# EasyEDA Pro project ProPrj_Backlight_esp32_dm135_2026-01-07.epro

# Schematic Schematic1
Board Name: Board1; Create Date: 2026-01-04; Page Name: P1; Project Name: Backlight_esp32_dm135; Schematic Name: Schematic1; Update Date: 2026-01-04; Company: EasyEDA.com; Page Size: A4; Version: V1.0
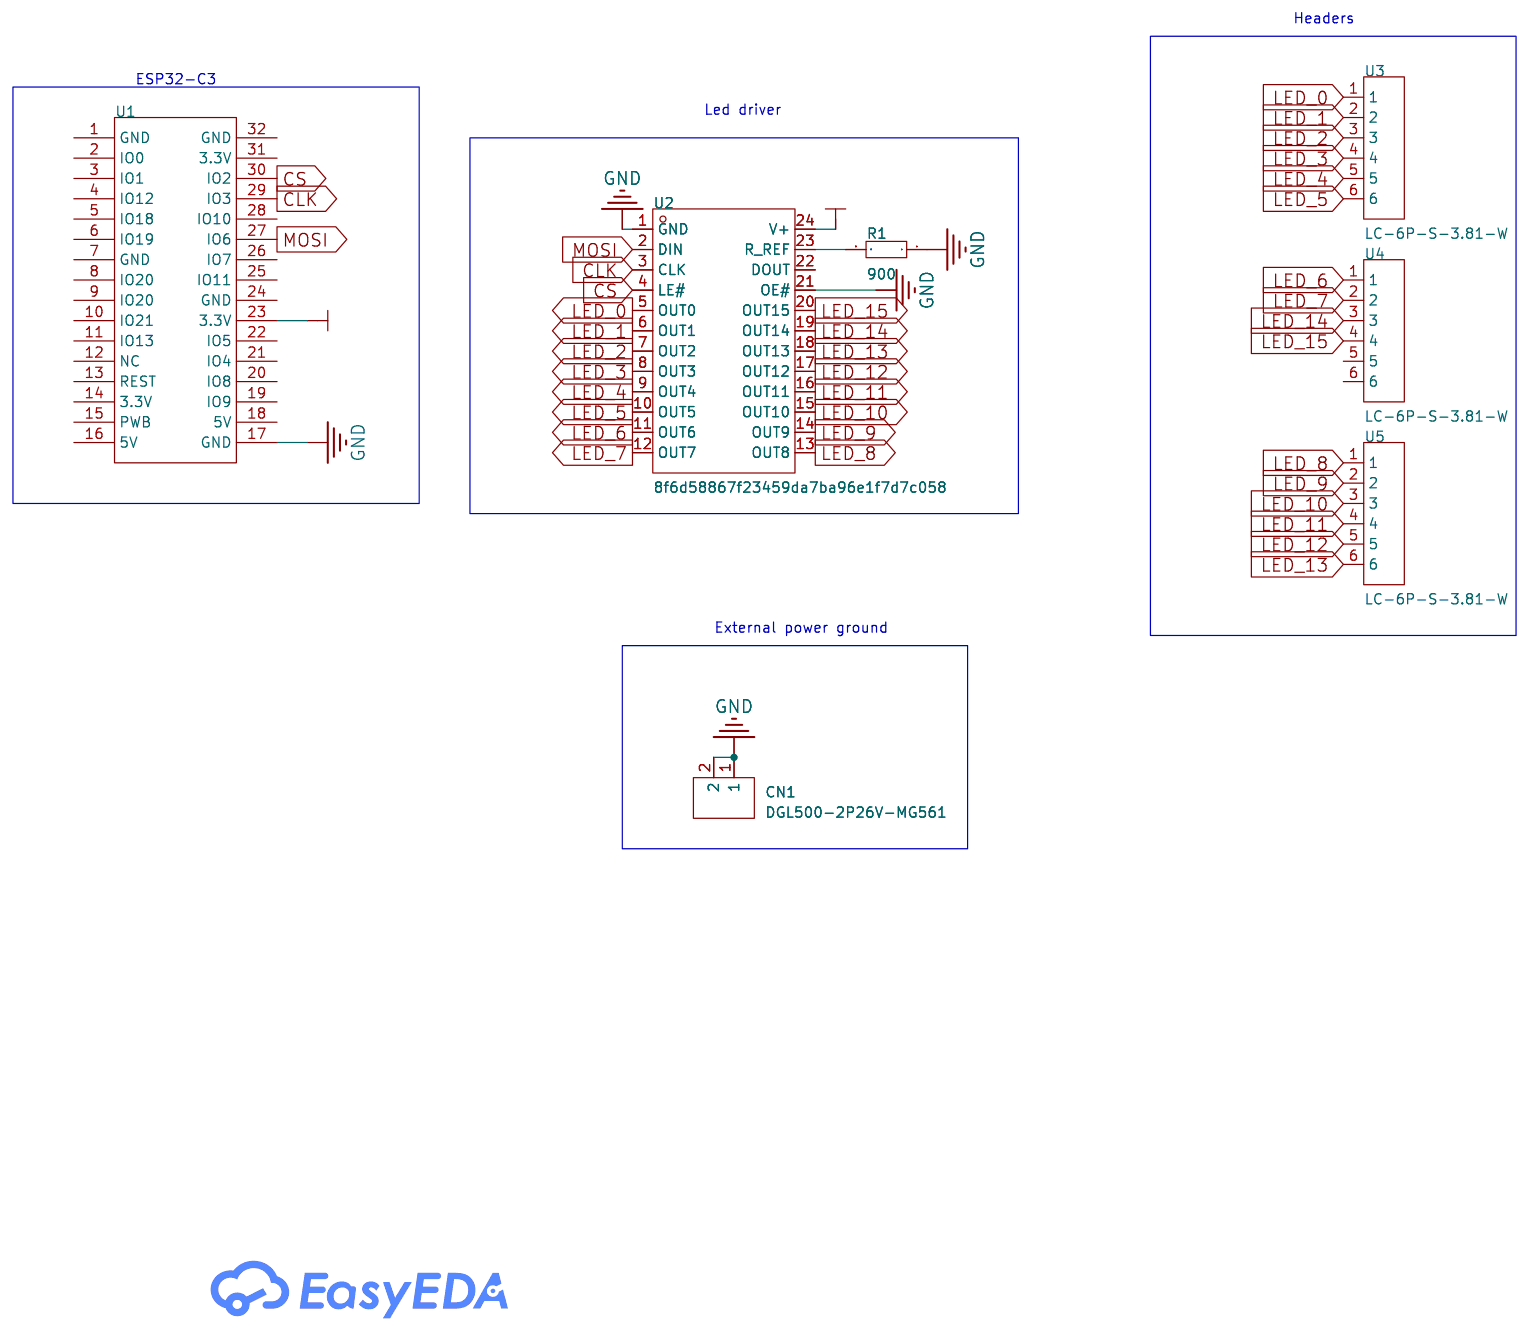
[diagram p0: schematic sheet]

## Parts
CN1  DGL500-2P26V-MG561  [CONN-TH_2P-P5.00_DGL500-2P26V-MG561]
R1  900  [RES-TH]
U1  -  [ESP32C3_Classic_LuatOS]
U2  8f6d58867f23459da7ba96e1f7d7c058  [CDIP-24_L32.4-W19.6-P2.54-LS15.2-BL]
U3  LC-6P-S-3.81-W  [CONN-TH_6P-P3.81_KF2EDGR-3.81-6P]
U4  LC-6P-S-3.81-W  [CONN-TH_6P-P3.81_KF2EDGR-3.81-6P]
U5  LC-6P-S-3.81-W  [CONN-TH_6P-P3.81_KF2EDGR-3.81-6P]

## Library data of the parts
CN1 = DGL500-2P26V-MG561: Number of Positions or Pins:1x2P Pitch:5mm Color:Green Mounting Type:Through Hole Number of Pins:2P Number of Rows:1 Number of PINs Per Row:2 Screw Specification:- Current Rating:18A Voltage Rating (Max):250V Wire Gauge - AWG:14~26 Wire Gauge - mm2:0.5~2.; LCSC Part Name: 1x2P 5mm 直插 排数:1 每排P数:2; Supplier Part: C49286620; Manufacturer: XUNPU(讯普); Supplier Footprint: 插件,P=5mm; JLCPCB Part Class: Extended Part; Datasheet: https://item.szlcsc.com/datasheet/DGL500-2P26V-MG561/51736379.html; Supplier: LCSC; Number of Positions or Pins: 1x2P; Pitch: 5mm; Color: Green; Mounting Type: Through Hole; Number of Pins: 2P; Number of Rows: 1; Number of PINs Per Row: 2; Current Rating: 18A; Voltage Rating (Max): 250V; Wire Gauge - AWG: 14~26; Wire Gauge - mm2: 0.5~2.5; Operating Temperature: -40℃~+105℃
R1 = Res_0603: Supplier Footprint: 0603
U1 = ESP32-C3-LUATOS
U2 = DM135B: Type:- Input Voltage:3V~5.5V Input Voltage:3V~5.5V Channels:16 Output Voltage:5.5V Output Voltage:5.5V Output Current:55mA Topology:- Operating temperature:-40℃~+125℃ Operating temperature:-40℃~+125℃; Supplier Footprint: SOIC-24-300mil; Datasheet: https://static.chipdip.ru/lib/776/DOC059776012.pdf; Input Voltage: 3V~5V; Channels: 16; Output Voltage: 17V; Output Current: 60mA
U3-U5 = LC-6P-S-3.81-W: Supplier Part: C9900011598; Supplier Footprint: 6-PIN-S; JLCPCB Part Class: Extended Part; Supplier: LCSC

## Nets
+3.3V: U1.23(3.3V) U2.24(V+)
GND: CN1.1 CN1.2 R1.1 U1.17(GND) U2.1(GND) U2.21(OE#)
CLK: U1.29(IO3) U2.3(CLK)
CS: U1.30(IO2) U2.4(LE#)
LED_0: U2.5(OUT0) U3.1
LED_1: U2.6(OUT1) U3.2
LED_2: U2.7(OUT2) U3.3
LED_3: U2.8(OUT3) U3.4
LED_4: U2.9(OUT4) U3.5
LED_5: U2.10(OUT5) U3.6
LED_6: U2.11(OUT6) U4.1
LED_7: U2.12(OUT7) U4.2
LED_8: U2.13(OUT8) U5.1
LED_9: U2.14(OUT9) U5.2
LED_10: U2.15(OUT10) U5.3
LED_11: U2.16(OUT11) U5.4
LED_12: U2.17(OUT12) U5.5
LED_13: U2.18(OUT13) U5.6
LED_14: U2.19(OUT14) U4.3
LED_15: U2.20(OUT15) U4.4
MOSI: U1.27(IO6) U2.2(DIN)
$1N2535: R1.2 U2.23(R_REF)

Not connected (* = marked no-connect by the designer): U1 1(GND) 2(IO0) 3(IO1) 4(IO12) 5(IO18) 6(IO19) 7(GND) 8(IO20) 9(IO20) 10(IO21) 11(IO13) 12(NC) 13(REST) 14(3.3V) 15(PWB) 16(5V) 18(5V) 19(IO9) 20(IO8) 21(IO4) 22(IO5) 24(GND) 25(IO11) 26(IO7) 28(IO10) 31(3.3V) 32(GND); U2 22(DOUT); U4 5 6

## Notes on the sheet
- Headers
- ESP32-C3
- Led driver
- External power ground

# Board PCB1
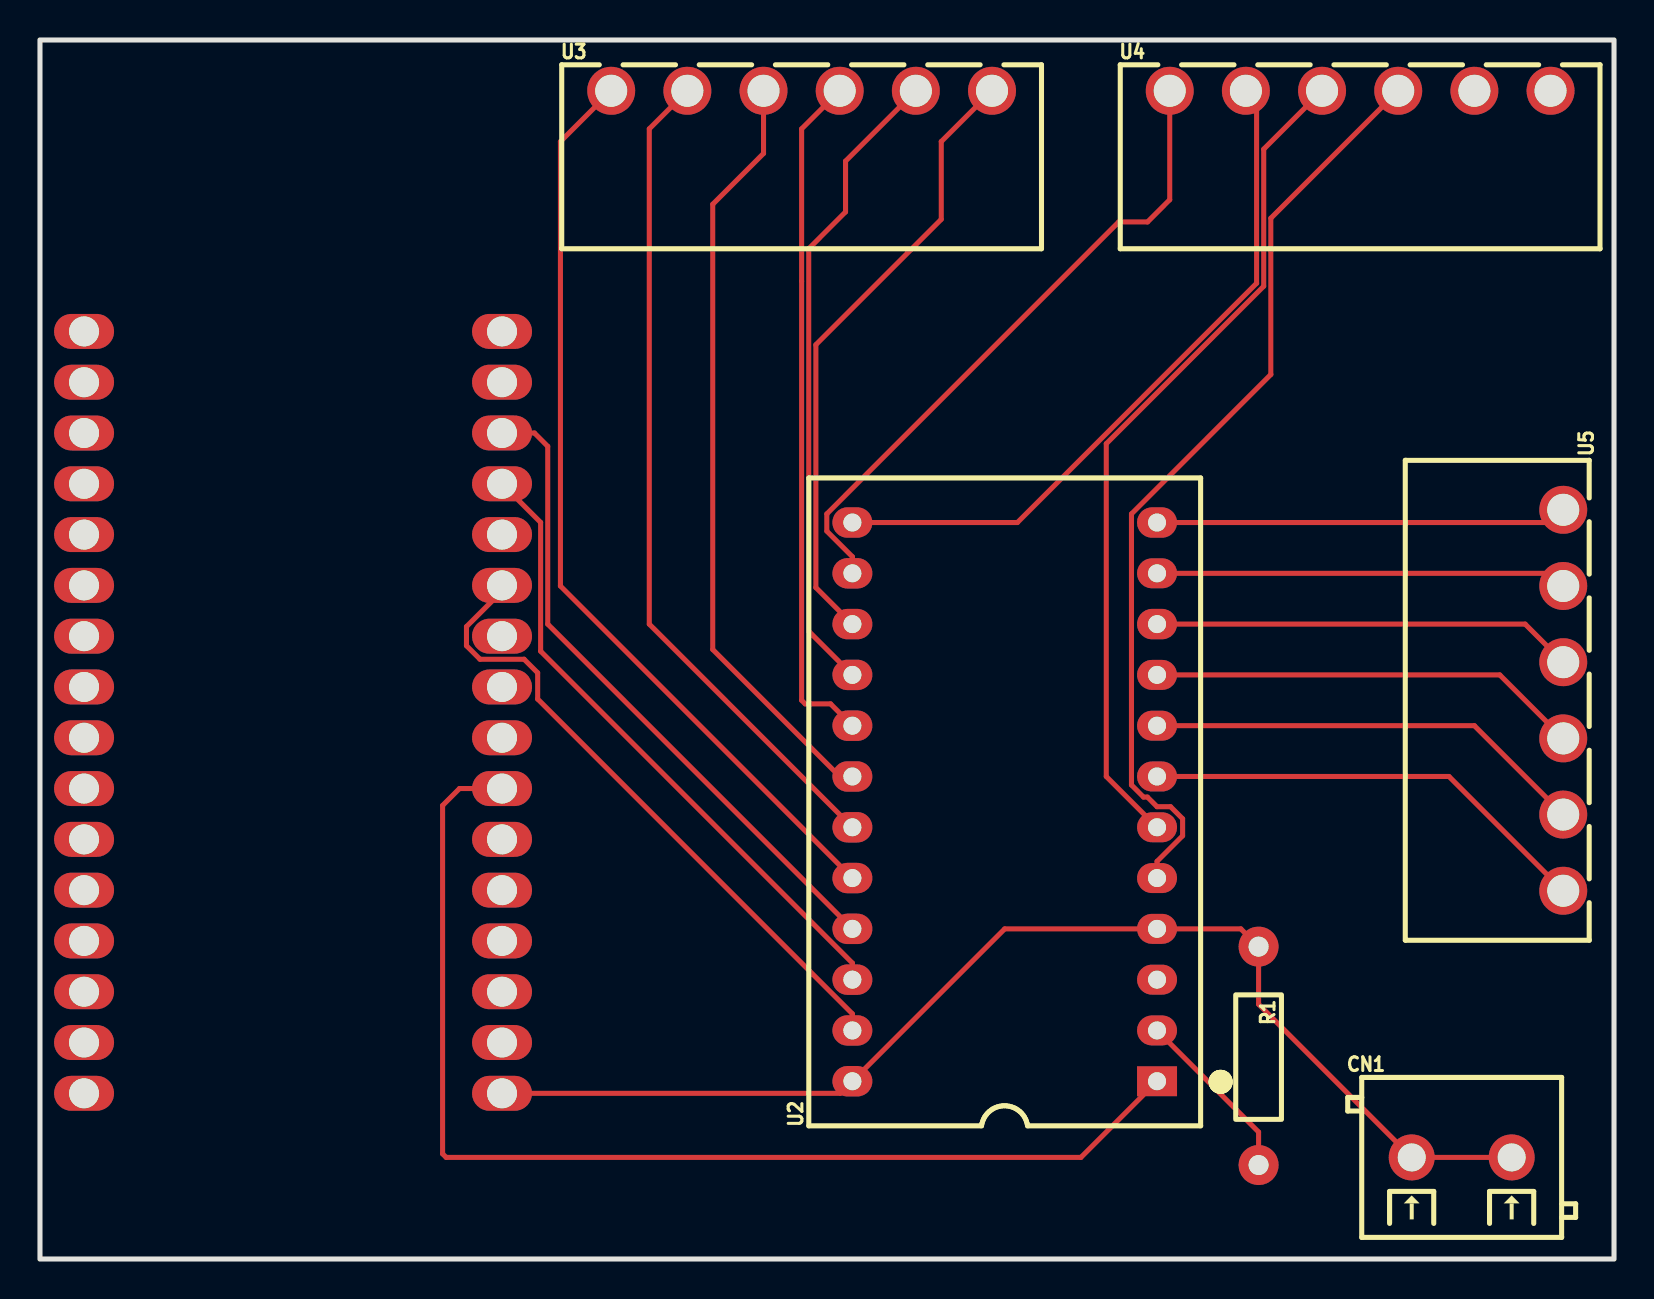
[diagram p1: board, top side]
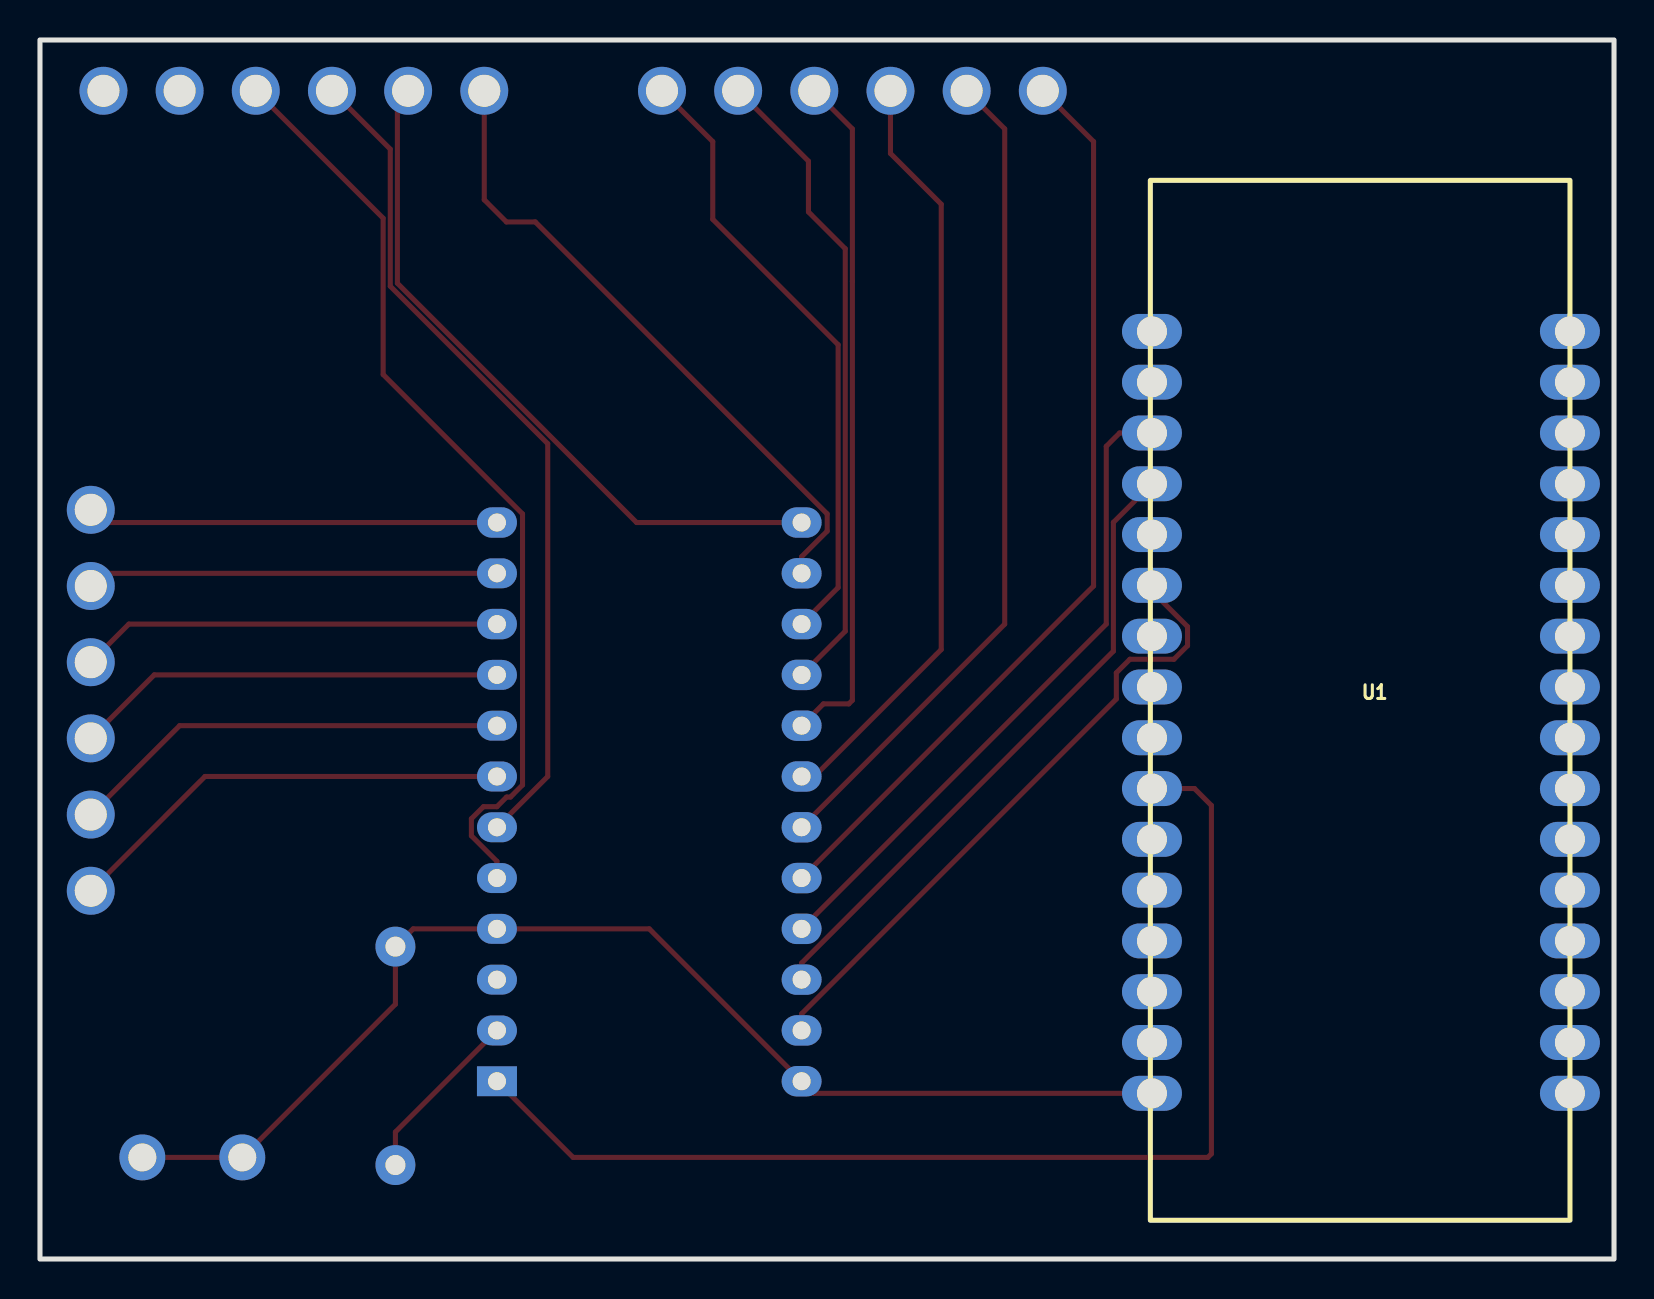
[diagram p2: board, bottom side, seen from below]

Outline 78.74 x 60.96 mm; copper layers: Top Layer, Bottom Layer. Coordinates in mm from the lower left corner of the outline.
Outline path: rectangle 0,60.96 78.74,0
Stack: Top Layer 0.035mm / Dielectric1 1.51mm FR4 er 4.5 / Bottom Layer 0.035mm

## Design rules (mm)
template: JLCPCB Capability(Two Layers Board)
spacing copperThickness1oz (default): track to track 0.102, other pairs 0.152 to 0.3
spacing copperThickness2oz: track to track 0.203, other pairs 0.152 to 0.3
track width copperThickness1oz (default): min 0.127, default 0.254, max 2.54
track width copperThickness2oz: min 0.203, default 0.254, max 2.54
differential pair differentialPair (default): width min 0.127, default 0.254, max 2.54; gap min 0.152, default 0.152
via viaSize (default): diameter min 0.5, default 0.61, max 10; hole min 0.3, default 0.305, max 6.3

## Placement (name value [footprint] x y rotation side)
CN1  DGL500-2P26V-MG561  [CONN-TH_2P-P5.00_DGL500-2P26V-MG561]  71.12 5.08 0 top
R1  900  [RES-TH]  60.96 10.16 270 top
U1  -  [ESP32C3_Classic_LuatOS]  12.7 27.94 0 bottom
U2  8f6d58867f23459da7ba96e1f7d7c058  [CDIP-24_L32.4-W19.6-P2.54-LS15.2-BL]  48.26 22.86 90 top
U3  LC-6P-S-3.81-W  [CONN-TH_6P-P3.81_KF2EDGR-3.81-6P]  38.1 58.42 0 top
U4  LC-6P-S-3.81-W  [CONN-TH_6P-P3.81_KF2EDGR-3.81-6P]  66.04 58.42 0 top
U5  LC-6P-S-3.81-W  [CONN-TH_6P-P3.81_KF2EDGR-3.81-6P]  76.2 27.94 270 top

## Footprints (pads in the part's own frame, mm; a bottom-side part is the same pattern mirrored in y, then rotated)
CDIP-24_L32.4-W19.6-P2.54-LS15.2-BL
  oval 1.524x2 hole 0.9: 1(-13.97,7.62) 2(-11.43,7.62) 3(-8.89,7.62) 4(-6.35,7.62) 5(-3.81,7.62) 6(-1.27,7.62) 7(1.27,7.62) 8(3.81,7.62) 9(6.35,7.62) 10(8.89,7.62) 11(11.43,7.62) 12(13.97,7.62) 13(13.97,-7.62) 15(8.89,-7.62)
  oval 1.5x2 hole 0.9: 14(11.43,-7.62) 16(6.35,-7.62) 17(3.81,-7.62) 18(1.27,-7.62) 19(-1.27,-7.62) 20(-3.81,-7.62) 21(-6.35,-7.62) 22(-8.89,-7.62) 23(-11.43,-7.62)
  rect 1.5x2 hole 0.9: 24(-13.97,-7.62)
CONN-TH_2P-P5.00_DGL500-2P26V-MG561
  round 2.3 hole 1.4: 1(-2.5,0) 2(2.5,0)
CONN-TH_6P-P3.81_KF2EDGR-3.81-6P
  round 2.4 hole 1.6: 1(-9.525,0) 2(-5.715,0) 3(-1.905,0) 4(1.905,0) 5(5.715,0) 6(9.525,0)
ESP32C3_Classic_LuatOS
  oval 3x1.75 hole 1.5x1: 1(-10.495,19.654) 2(-10.495,17.114) 3(-10.495,14.574) 4(-10.495,12.034) 5(-10.495,9.494) 6(-10.495,6.954) 7(-10.495,4.414) 8(-10.495,1.874) 9(-10.495,-0.666) 10(-10.495,-3.206) 11(-10.495,-5.746) 12(-10.495,-8.286) 13(-10.495,-10.826) 14(-10.495,-13.366) 15(-10.495,-15.906) 16(-10.495,-18.447) 17(10.414,19.654) 18(10.414,17.114) 19(10.414,14.574) 20(10.414,12.034) 21(10.414,9.493) 22(10.414,6.954) 23(10.414,4.413) 24(10.414,1.873) 25(10.414,-0.666) 26(10.414,-3.207) 27(10.414,-5.747) 28(10.414,-8.287) 29(10.414,-10.827) 30(10.414,-13.367) 31(10.414,-15.907) 32(10.414,-18.447)
RES-TH
  round 2 hole 1: 1(-5.461,0) 2(5.461,0)

## Nets
As in the schematic.

Pads without a net: U1 1 2 3 4 5 6 7 8 9 10 11 12 13 14 15 16 18 19 20 21 22 24 25 26 28 31 32; U2 22; U4 5 6

## Routing (per net, layer and track width the routed paths; a pad name or vN(x,y) marks a point on that pad's centre or on a via; arc(x,y) is an arc through that point)
+3.3V: length 58.1
  Top Layer w0.254: U2.24 52.07,5.08 20.32,5.08 20.14,5.26 20.14,22.68 20.99,23.53 U1.23
GND: length 60.3
  Top Layer w0.254: U1.17 40.04,8.29 U2.1 48.26,16.51 U2.21 60.07,16.51 R1.1 60.96,12.74 CN1.1 CN1.2
CLK: length 32.1
  Top Layer w0.254: U2.3 40.64,14.8 25.04,30.4 25.04,36.84 U1.29
CS: length 33
  Top Layer w0.254: U2.4 25.4,31.75 25.4,40.64 24.73,41.31 U1.30
LED_0: length 46.5
  Top Layer w0.254: U3.1 26.03,55.88 26.03,33.66 U2.5
LED_1: length 41.8
  Top Layer w0.254: U3.2 30.48,56.52 30.48,31.75 U2.6
LED_2: length 38.6
  Top Layer w0.254: U2.7 40,24.13 33.66,30.48 33.66,52.75 36.19,55.29 U3.3
LED_3: length 34.3
  Top Layer w0.254: U2.8 39.55,27.76 38.28,27.76 38.1,27.94 38.1,56.52 U3.4
LED_4: length 32.3
  Top Layer w0.254: U3.5 40.3,54.9 40.3,52.36 38.46,50.52 38.46,31.39 U2.9
LED_5: length 31.1
  Top Layer w0.254: U2.10 38.81,33.58 38.81,45.72 45.09,51.99 45.09,55.88 U3.6
LED_6: length 32.6
  Top Layer w0.254: U4.1 56.51,52.97 55.4,51.86 53.96,51.86 39.36,37.26 39.36,36.4 40.64,35.12 U2.11
LED_7: length 35
  Top Layer w0.254: U2.12 48.9,36.83 60.86,48.8 60.86,57.88 U4.2
LED_8: length 20.6
  Top Layer w0.254: U2.13 75.56,36.83 U5.1
LED_9: length 20.6
  Top Layer w0.254: U5.2 75.57,34.29 U2.14
LED_10: length 21.1
  Top Layer w0.254: U5.3 74.29,31.75 U2.15
LED_11: length 21.6
  Top Layer w0.254: U2.16 73.03,29.21 U5.4
LED_12: length 22.2
  Top Layer w0.254: U5.5 71.75,26.67 U2.17
LED_13: length 22.7
  Top Layer w0.254: 76.2,18.42 70.49,24.13 U2.18
LED_14: length 42.4
  Top Layer w0.254: U2.19 53.34,24.13 53.34,40.77 61.22,48.65 61.22,55.5 U4.3
LED_15: length 47
  Top Layer w0.254: U2.20 55.88,19.89 57.16,21.16 57.16,22.02 56.56,22.62 55.88,22.62 55.4,23.1 55.2,23.1 54.6,23.7 54.6,37.26 61.57,44.23 61.57,52.05 U4.4
MOSI: length 32.3
  Top Layer w0.254: U1.27 23.11,33.4 21.34,31.62 21.34,30.67 22.01,29.99 24.22,29.99 24.9,29.31 24.9,28 40.64,12.26 U2.2
$1N2535: length 8.8
  Top Layer w0.254: U2.23 60.96,6.35 60.96,4.7
